# Altium schematic sheet HaptikGeriBeslemeDevresi_Schematic.SchDoc
size A4; SheetNumber: 1; SheetTotal: 1
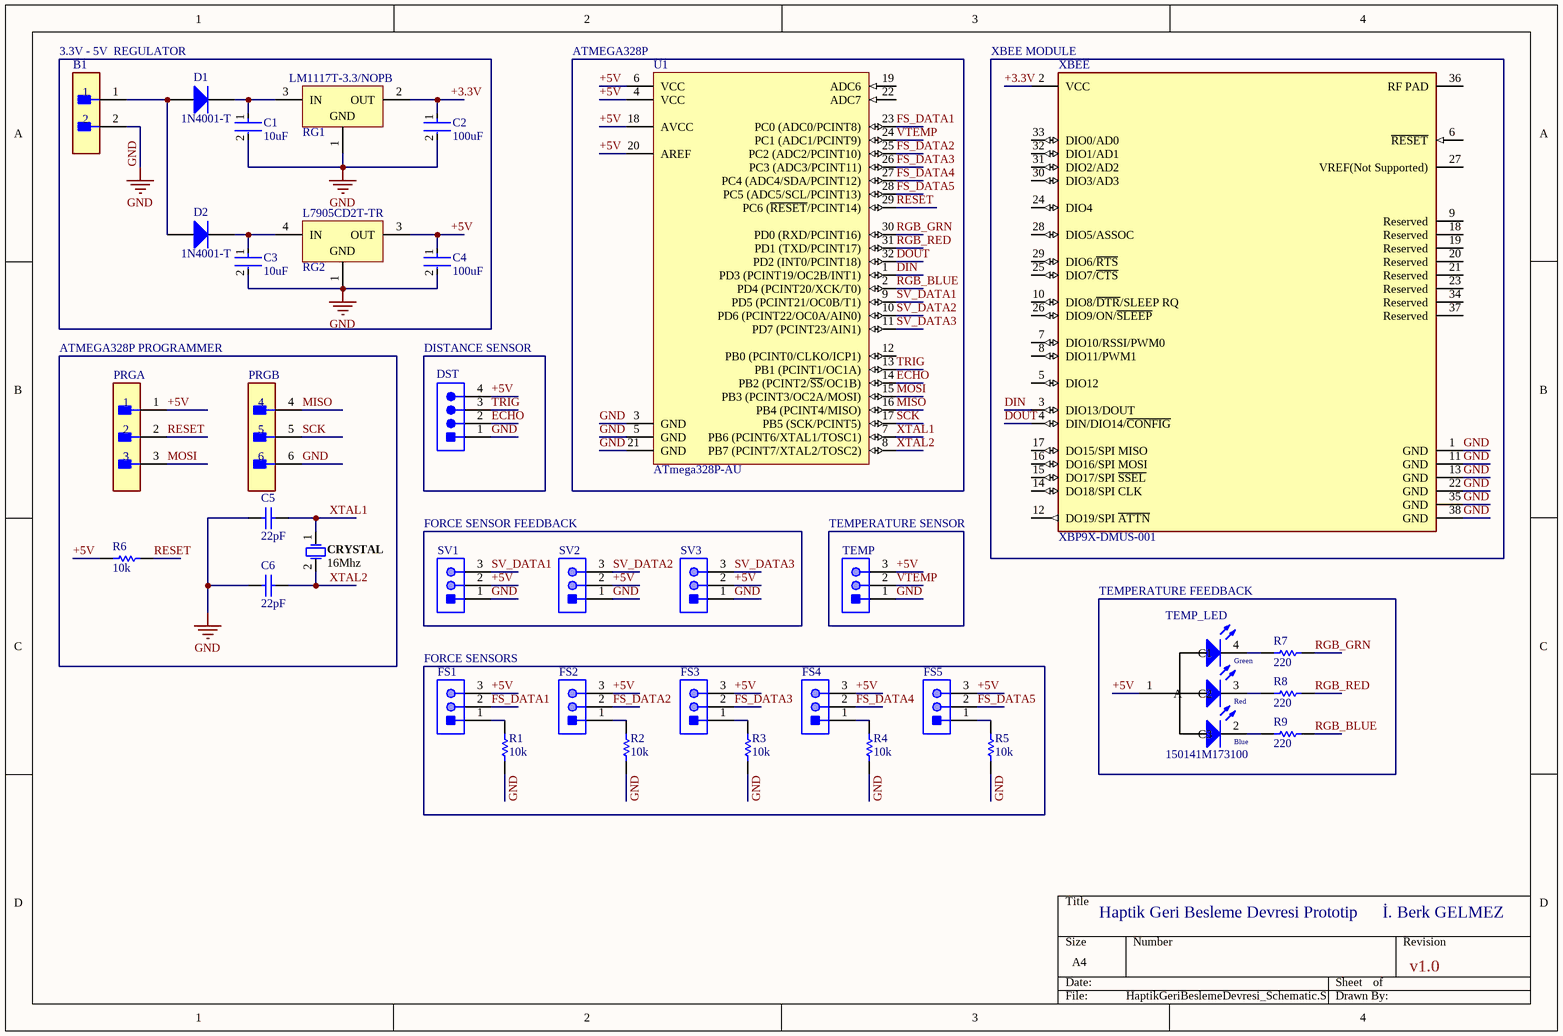
[diagram p0: HaptikGeriBeslemeDevresi_Schematic.SchDoc]

## Parts
B1  90136-1202  [FP-90136-1202-MFG]  (value not drawn)
C1  10uF  [FP-C1608-080-MFG]
C2  100uF  [FP-C3216X5R1A107M160AC-MFG]
C3  10uF  [FP-GRM21B-0_1-IPC_C]
C4  100uF  [FP-C3216X5R1A107M160AC-MFG]
C5  22pF  [CAPC1608X90X35ML10T15]
C6  22pF  [CAPC1608X90X35ML10T15]
CRYSTAL  16Mhz  [FOX-FOXSLF160-20]
D1  1N4001-T  [DIOD-DO-41-P-2_V]
D2  1N4001-T  [DIOD-DO-41-P-2_V]
DST  B4B-EH-A(LF)(SN)  [JST-B4B-EH-A_V]  (value not drawn)
FS1  B3B-PH-K-S(LF)(SN)  [JST-B3B-PH-K-S-3_V]  (value not drawn)
FS2  B3B-PH-K-S(LF)(SN)  [JST-B3B-PH-K-S-3_V]  (value not drawn)
FS3  B3B-PH-K-S(LF)(SN)  [JST-B3B-PH-K-S-3_V]  (value not drawn)
FS4  B3B-PH-K-S(LF)(SN)  [JST-B3B-PH-K-S-3_V]  (value not drawn)
FS5  B3B-PH-K-S(LF)(SN)  [JST-B3B-PH-K-S-3_V]  (value not drawn)
PRG  IPL1-103-02-L-D-K  [FP-IPL1-103-02-L-D-K-0]  (value not drawn)  (parts A,B of 2)
R1  10k  [RESC1609X55X30LL15T15]
R2  10k  [RESC1609X55X30LL15T15]
R3  10k  [RESC1609X55X30LL15T15]
R4  10k  [RESC1609X55X30LL15T15]
R5  10k  [RESC1609X55X30LL15T15]
R6  10k  [RESC1609X55X30LL15T15]
R7  220  [RESC1608X55X30LL15T15]
R8  220  [RESC1608X55X30LL15T15]
R9  220  [RESC1608X55X30LL15T15]
RG1  LM1117T-3.3/NOPB  [NDE0003A]
RG2  L7905CD2T-TR  [TO-263_L]
SV1  B3B-PH-K-S(LF)(SN)  [JST-B3B-PH-K-S-3_V]  (value not drawn)
SV2  B3B-PH-K-S(LF)(SN)  [JST-B3B-PH-K-S-3_V]  (value not drawn)
SV3  B3B-PH-K-S(LF)(SN)  [JST-B3B-PH-K-S-3_V]  (value not drawn)
TEMP  B3B-PH-K-S(LF)(SN)  [JST-B3B-PH-K-S-3_V]  (value not drawn)
TEMP_LED  150141M173100  [3528_A]
U1  ATmega328P-AU  [32A_M]
XBEE  XBP9X-DMUS-001  [FP-XBP9X-DMUS-001-MFG]

## Nets
GND: B1.2 C1.2 C2.2 C3.2 C4.2 C5.1 C6.1 DST.1 PRG.6 R1.1 R2.1 R3.1 R4.1 R5.1 RG1.1(GND) RG2.1(GND) SV1.1 SV2.1 SV3.1 TEMP.1 U1.3(GND) U1.5(GND) U1.21(GND) XBEE.1(GND) XBEE.11(GND) XBEE.13(GND) XBEE.22(GND) XBEE.35(GND) XBEE.38(GND)
+3.3V: C2.1 RG1.2(OUT) XBEE.2(VCC)
+5V: C4.1 DST.4 FS1.3 FS2.3 FS3.3 FS4.3 FS5.3 PRG.1 R6.2 RG2.3(OUT) SV1.2 SV2.2 SV3.2 TEMP.3 TEMP_LED.1(A) U1.4(VCC) U1.6(VCC) U1.18(AVCC) U1.20(AREF)
DIN: U1.1(PD3_(PCINT19/OC2B/INT1)) XBEE.3(DIO13/DOUT)
DOUT: U1.32(PD2_(INT0/PCINT18)) XBEE.4(DIN/DIO14/~{CONFIG})
ECHO: DST.2 U1.14(PB2_(PCINT2/~{SS}/OC1B))
FS_DATA1: FS1.2 U1.23(PC0_(ADC0/PCINT8))
FS_DATA2: FS2.2 U1.25(PC2_(ADC2/PCINT10))
FS_DATA3: FS3.2 U1.26(PC3_(ADC3/PCINT11))
FS_DATA4: FS4.2 U1.27(PC4_(ADC4/SDA/PCINT12))
FS_DATA5: FS5.2 U1.28(PC5_(ADC5/SCL/PCINT13))
MISO: PRG.4 U1.16(PB4_(PCINT4/MISO))
MOSI: PRG.3 U1.15(PB3_(PCINT3/OC2A/MOSI))
RESET: PRG.2 R6.1 U1.29(PC6_(~{RESET}/PCINT14))
RGB_BLUE: R9.2 U1.2(PD4_(PCINT20/XCK/T0))
RGB_GRN: R7.2 U1.30(PD0_(RXD/PCINT16))
RGB_RED: R8.2 U1.31(PD1_(TXD/PCINT17))
SCK: PRG.5 U1.17(PB5_(SCK/PCINT5))
SV_DATA1: SV1.3 U1.9(PD5_(PCINT21/OC0B/T1))
SV_DATA2: SV2.3 U1.10(PD6_(PCINT22/OC0A/AIN0))
SV_DATA3: SV3.3 U1.11(PD7_(PCINT23/AIN1))
TRIG: DST.3 U1.13(PB1_(PCINT1/OC1A))
VTEMP: TEMP.2 U1.24(PC1_(ADC1/PCINT9))
XTAL1: C5.2 CRYSTAL.1 U1.7(PB6_(PCINT6/XTAL1/TOSC1))
XTAL2: C6.2 CRYSTAL.2 U1.8(PB7_(PCINT7/XTAL2/TOSC2))
NetB1_1: B1.1 D1.1(A) D2.1(A)
NetC1_1: C1.1 D1.2(K) RG1.3(IN)
NetC3_1: C3.1 D2.2(K) RG2.4(IN)
NetFS1_1: FS1.1 R1.2
NetFS2_1: FS2.1 R2.2
NetFS3_1: FS3.1 R3.2
NetFS4_1: FS4.1 R4.2
NetFS5_1: FS5.1 R5.2
NetR7_1: R7.1 TEMP_LED.4(C1)
NetR8_1: R8.1 TEMP_LED.3(C2)
NetR9_1: R9.1 TEMP_LED.2(C3)

Not connected (* = marked no-connect by the designer): U1 12(PB0_(PCINT0/CLKO/ICP1)) 19(ADC6) 22(ADC7); XBEE 5(DIO12) 6(~{RESET}) 7(DIO10/RSSI/PWM0) 8(DIO11/PWM1) 9(Reserved) 10(DIO8/~{DTR}/SLEEP_RQ) 12(DO19/SPI_~{ATTN}) 14(DO18/SPI_CLK) 15(DO17/SPI_~{SSEL}) 16(DO16/SPI_MOSI) 17(DO15/SPI_MISO) 18(Reserved) 19(Reserved) 20(Reserved) 21(Reserved) 23(Reserved) 24(DIO4) 25(DIO7/~{CTS}) 26(DIO9/ON/~{SLEEP}) 27(VREF(Not_Supported)) 28(DIO5/ASSOC) 29(DIO6/~{RTS}) 30(DIO3/AD3) 31(DIO2/AD2) 32(DIO1/AD1) 33(DIO0/AD0) 34(Reserved) 36(RF_PAD) 37(Reserved)

## Notes on the sheet
- 3.3V - 5V  REGULATOR
- (near U1) ATMEGA328P
- (near XBEE) XBEE MODULE
- ATMEGA328P PROGRAMMER
- (near DST) DISTANCE SENSOR
- FORCE SENSOR FEEDBACK
- (near TEMP) TEMPERATURE SENSOR
- TEMPERATURE FEEDBACK
- (near FS1) FORCE SENSORS
- Haptik Geri Besleme Devresi Prototip
- İ. Berk GELMEZ
- v1.0
- (in symbol CMP-1431-00001-1) Green; Red; Blue

## Library data of the parts
B1 = CMP-04776-000259-1: CONN HEADER VERT 2POS 2.54MM; Insulation Resistance: 5GR; Max Voltage Rating (DC): 350.35kV; Voltage Rating (AC): 350V; Number of Contacts: 2; Gender: Male; Glow Wire Compliant: Non-compliant; Contact Resistance: 20mR; Current Rating: 3A; Series: C-Grid III; Contact Material: Brass; Contact Plating: Gold; Flammability Rating: UL94 V-0; Housing Color: Black; Max Operating Temperature: 125°C; Housing Material: Polyester; Min Operating Temperature: -55°C; Package Quantity: 3040; Voltage Rating: 350V; Number of Positions: 2; Working Voltage: 350V; Lead Pitch: 2.54mm; Termination: Through Hole; Color: Black; Packaging: Tray; Lead Free: Lead Free; Voltage Rating (DC): 350V; Orientation: Vertical; Number of Poles: 2; RoHS Compliant: Yes; Number of Rows: 1; Pitch: 2.54mm; Radiation Hardening: No; Number of Circuits: 2; Mount: Through Hole
C1 = CMP-2000-04979-2: CAP CER 10UF 10V X5R 0603; Manufacturer Part Number: C1608X5R1A106K080AC; Manufacturer: TDK; Temperature Coefficient: 15%; Tolerance: 10%; Material: Ceramic; Mouser Description: CAP CER 10UF 10V X5R 0603; Package: C1608-080; Lead Free: Yes; Device Class L1: Passive Components; Value: 10uF; Temperature Range High: +85°C; Octopart: https://octopart.com/c1608x5r1a106k080ac-tdk-26013468; Voltage: 10V; Footprint Url: https://product.tdk.com/info/en/catalog/spec/mlccspec_commercial_general_midvoltage_en.pdf; Ipc Land Pattern Name: CAPC16080X80; Temperature Range Low: -55°C; Temperature: -55°C to +85°C; ComponentLink2Description: Datasheet; ComponentLink2URL: https://product.tdk.com/info/en/documents/chara_sheet/C1608X5R1A106K080AC.pdf; Height: 0.9mm; Temperature Characteristic: X5R; RoHS: TRUE; Category: Cap; Capacitance: 10uF; Digikey Description: CAP CER 10UF 10V X5R 0603; Automotive: No; Device Class L3: Ceramic Capacitors; Device Class L2: Capacitors; Voltage Rating: 10V
C2 C4 = CMP-2000-05396-2: CAP CER 100UF 10V X5R 1206; Manufacturer: TDK Corporation; Manufacturer Part Number: C3216X5R1A107M160AC; Temperature Coefficient: 15%; Tolerance: 20%; Material: Ceramic; Voltage Rating: 10V; Automotive: No; Ipc Land Pattern Name: CAPC320160X160; Height: 1.9mm; ComponentLink2URL: https://product.tdk.com/info/en/catalog/spec/mlccspec_commercial_general_midvoltage_en.pdf; Temperature: -55°C to +85°C; Lead Free: Yes; Digikey Description: CAP CER 100UF 10V X5R 1206; Device Class L2: Capacitors; Device Class L3: Ceramic Capacitors; Capacitance: 100uF; Temperature Characteristic: X5R; Package: C3216X5R1A107M160AC; Temperature Range High: +85°C; Category: Cap; Device Class L1: Passive Components; Value: 100uF; Octopart: https://octopart.com/c3216x5r1a107m160ac-tdk-25947775; Temperature Range Low: -55°C; RoHS: TRUE; ComponentLink2Description: Datasheet; Mouser Description: CAP CER 100UF 10V X5R 1206
C3 = CMP-2007-03453-2: Chip Multilayer Ceramic Capacitors for General Purpose, 0805, 10uF, X5R, 15%, 10%, 16V; Radiation Hardening: No; Thickness: 0.053inch; Voltage Rating (DC): 16V; Lead Free: Lead Free; Package Quantity: 1; Width: 1.25mm; Case Code (Imperial): 0805; Depth: 1.25mm; Packaging: Tape and Reel; Dielectric: X5R; Max Operating Temperature: 85°C; Tolerance: 10%; Voltage Rating: 16V; Voltage: 16V; Capacitance: 10uF; Height: 1.25mm; Case Code (Metric): 2012; Material: Ceramic; Mount: Surface Mount; Case/Package: 0805; REACH SVHC: No SVHC; Length: 2mm; Min Operating Temperature: -55°C; Termination: SMD/SMT
C5 C6 = CMP-2000-04945-1: Chip Capacitor, 22 pF, +/- 5%, 50 V, -55 to 125 degC, 0603 (1608 Metric), RoHS, Tape and Reel; Manufacturer: Murata; Rated Voltage: 50V; Dielectric: C0G; Capacitance: 22pF; Manufacturer URL: http://www.murata.com/; Datasheet Version: Jul-06; Package Reference: 603; Tolerance (%): ±5%; Case Size/Dimension: 0603; Package Description: 2-Pin Surface Mount Device, Body 1.6 x 0.8 mm; Datasheet URL: https://datasheet.ciiva.com/11786/0900766b807a1cab-11786398.pdf
CRYSTAL = CMP-1749-00003-1: Resistance Weld Thru-Hole Crystal, 16 MHz, -20 to 70 degC, 2-Pin THD, RoHS, Bulk; Voltage Rating: 250 V; Tolerance: 1%; Resistance: 221 kohm; Case\Package: Axial; Power Rating: 250 mW; RoHSCompliant: true; Package Quantity: 200; Packaging: Bulk; Min Operating Temperature: -55 degC; DatasheetVersion: Mar-15; ComponentLink1URL: http://www.foxonline.com/; Max Operating Temperature: 155 degC; PackageReference: FOXSLF160-20; Mount: Through Hole; PackageDescription: 2-Pin Through Hole Device, Body 11.35 x 4.65 mm; ComponentLink1Description: Manufacturer URL; ComponentLink2URL: http://www.foxonline.com/pdfs/hc49slf.pdf; ComponentLink2Description: Datasheet; Length: 0.248 inch
D1 D2 = CMP-0639-00006-2: 1.0 A Rectifier, 15 pF, 50 V, -65 to 150 degC, 2-Pin DO-41 Plastic, RoHS, Tape and Reel; Manufacturer: Diodes Inc; VF (V): 1; CT (pF): 15; Max. IR (uA): 5; VRRM (V): 50; Max. IFSM (A): 30; RoHS: TRUE; Mounting Technology: Through Hole; PartNumber: 1N4001-T; ComponentLink2Description: Datasheet; DatasheetVersion: Rev. 8-2; Operating Temperature Range (degC): -65 to 150; Packing: Tape and Reel; PackageReference: DO-41-P-2; ComponentLink1URL: http://diodes.com/; PackageDescription: 2-Pin Axial Lead, Body 4.635 x 2.36 mm, Lead Spread 25.4 mm; ComponentLink2URL: http://diodes.com/datasheets/ds28002.pdf; Max. Average Rectified Current IO (A): 1; ComponentLink1Description: Manufacturer URL
DST = CMP-2000-05904-1: Male Header, Pitch 2.5 mm, 1 x 4 Position, Height 6 mm, Tail Length 3.2 mm, -25 to 85 degC, RoHS, Bulk; Manufacturer: JST; Style/Orientation: StraightHeader/Plug; Pitch: 2.5mm; No of Positions: 4; Mounting Technology: SurfaceMount; Package Description: Male Header, Pitch 2.5 mm, 1 x 4 Position, Height 6 mm, Tail Length 3.2 mm; Datasheet Version: 12/2012; Type: ShroudedHeader; Package Reference: B4B-EH-A; Manufacturer URL: http://www.jst.com/home2.html; Termination: Crimp; Datasheet URL: http://www.jst-mfg.com/product/pdf/eng/eEH.pdf
FS1-FS5 SV1-SV3 TEMP = CMP-2000-05164-1: Male Header, Pitch 2 mm, 1 x 3 Position, Height 6 mm, Tail Length 3.4 mm, -25 to 85 degC, RoHS, Bulk; Manufacturer: JST; Style/Orientation: StraightHeader/Plug; Pitch: 2mm; No of Positions: 3; Termination: Crimp; Manufacturer URL: http://www.jst.com/home2.html; Datasheet Version: Oct-06; Type: ShroudedHeader; Datasheet URL: https://datasheet.ciiva.com/11746/0900766b80826550-11746939.pdf
PRG = CMP-02766-000692-1: 3 Position 2 Row .100" (2.54 mm) pitch connector; Pitch: 2.54mm; Max Current Rating: 7.4A; Max Voltage Rating (AC): 675V; Number of Ports: 1; Number of Contacts: 6; Gender: Male; Housing Material: Polymer; Depth: 9.58mm; Orientation: Straight; Termination: Solder; Mount: Surface Mount; Length: 9.14mm; Packaging: Bulk; Contact Material: Bronze; Max Operating Temperature: 125°C; Contact Plating: Gold; Radiation Hardening: No; Min Operating Temperature: -55°C; Number of Terminals/Pins: 6
R1-R6 = CMP-1012-00623-3: Chip Resistor, 10 KOhm, +/- 1%, 0.1 W, -55 to 155 degC, 0603 (1608 Metric), RoHS, Tape and Reel; Manufacturer: Panasonic; Voltage Rating: 75V; Case\/Package: 0603; Power Rating: 100mW; Resistance: 10KOhm; Temperature Coefficient: 100ppm\/degreesC; Number of Pins: 2; Package Reference: 603; Depth: 0.8mm; Mount: SurfaceMount; Package Description: 2-Pin Surface Mount Device, Body 1.6 x 0.85 mm; Datasheet Version: 02/2017; Length: 1.6mm; Lead Free: LeadFree; Height: 0.45mm; Number of Terminations: 2; Max Power Dissipation: 100mW; Min Operating Temperature: -55degC; Datasheet URL: https://industrial.panasonic.com/cdbs/www-data/pdf/RDA0000/AOA0000C304.pdf; Termination: SMD/SMT; Case Code (Metric): 1608; Case Code (Imperial): 0603; Tolerance: 1%; Max Operating Temperature: 155degC; RoHSCompliant: true; Voltage Rating (DC): 75V; Radiation Hardening: No; Packaging: TapeandReel; Composition: ThickFilm; Mounting Technology: SurfaceMount; Manufacturer URL: http://www.panasonic.com/; Width: 0.031inch; REACH SVHC: NoSVHC; Contact Plating: Tin; Military Standard: Not; Package Quantity: 1
R7-R9 = CMP-2000-00335-2: Chip Resistor, 220 Ohm, +/- 1%, 0.1 W, -55 to 155 degC, 0603 (1608 Metric), RoHS, Tape and Reel; Voltage Rating: 50 V; Resistance: 22 Ohm; Power Rating: 100 mW; Case\Package: 0603; ComponentLink2Description: Datasheet; PackageDescription: 2-Pin Surface Mount Device, Body 1.6 x 0.85 mm; PackageReference: 0603; ComponentLink1Description: Manufacturer URL; ComponentLink2URL: http://industrial.panasonic.com/cdbs/www-data/pdf/RDA0000/AOA0000C86.pdf; Height: 0.45 mm; Mount: Surface Mount; Case Code (Metric): 1608; Pins: 2; Width: 0.8 mm; Length: 1.6 mm; Package Quantity: 5000; Tolerance: 1%; ComponentLink1URL: http://www.panasonic.com/; Max Operating Temperature: 155 degC; Min Operating Temperature: -55 degC; RoHSCompliant: true; Packaging: Tape and Reel; Case Code (Imperial): 0603; DatasheetVersion: Apr-15; REACH SVHC: No SVHC; Voltage Rating (DC): 50 V
RG1 = CMP-0062-02494-3: 800mA Low-Dropout Linear Regulator, 3-pin TO-220, Pb-Free; Manufacturer: Texas Instruments; PackageTopMarking: NSUZXYTTE#*LM1117T*3.3; PowerWise: N; CompType: LDO IC; RoHS: Y; ComponentLink1URL: http://www.ti.com/general/docs/lit/getliterature.tsp?genericPartNumber=LM1117-N&fileType=pdf; PackageReference: NDE0003A; PinCount: 3; ComponentLink1Description: Datasheet URL; PackageDescription: TO-220, Molded, 3 Lead, Straight
RG2 = CMP-0244-00191-1: Negative Voltage Regulator, -5V, 3-Pin D2PAK, Tape and Reel; PackageReference: TO-263; ComponentLink2URL: http://www.st.com/internet/com/TECHNICAL_RESOURCES/TECHNICAL_LITERATURE/DATASHEET/CD00000450.pdf; PackageVersion: 2011; ComponentLink1Description: Manufacturer URL; ComponentLink2Description: Datasheet; PackageDescription: 3-Pin Transistor Outline Package 2.54 mm Pitch, 15.4 mm Lead Span (D2PAK); ComponentLink1URL: http://www.st.com; DatasheetVersion: 1/11/2011
TEMP_LED = CMP-1431-00001-1: SMD Full-Color Top LED, WL-SFTW, Red & Green & Blue; Manufacturer: Wuerth Elektronik; PackageReference: 3528_A; PartNumber: 150141M173100; ComponentLink2Description: Datasheet; ComponentLink1URL: http://www.we-online.com; Color: Red & Green & Blue; ComponentLink1Description: Manufacturer URL; ComponentLink2URL: http://katalog.we-online.com/led/datasheet/150141M173100.pdf
U1 = CMP-0095-00269-2: 8-bit AVR Microcontroller, 32KB Flash, 1KB EEPROM, 2KB SRAM, 32-pin TQFP, Industrial Grade (-40°C to 85°C); PackageDescription: 32-Lead, 7x7x1.0 mm Body, 0.8mm Lead Pitch, Thin Profile Plastic Quad Flat Package (TQFP); DatasheetVersion: revD, May-2011; RevisionNote: DatasheetVersion & PackageVersion updated. URLs added.; ComponentLink1URL: http://www.atmel.com/; ComponentLink2Description: ATmega48A/48PA/88A/88PA/168A/168PA/328/328P Datasheet; Code_JEDEC: MS-026-ABA; ComponentLink1Description: Manufacturer URL; PackageReference: 32A; ComponentLink3Description: ATmega48A/48PA/88A/88PA/168A/168PA/328/328P Summary; ComponentLink2URL: http://www.atmel.com/dyn/resources/prod_documents/doc8271.pdf; PackageVersion: revC, Oct-2010; ComponentLink3URL: http://www.atmel.com/dyn/resources/prod_documents/8271S.pdf
XBEE = CMP-84319-000001-1: XBEE PRO MOD TXRX ISM 915MHZ UFL; Manufacturer: Digi International; Min Supply Voltage: 2.4V; Max Supply Voltage: 3.6V; Number Of Adc Channels: 4; Interface: SPI,UART; Receiving Current: 40mA; Bandwidth: 26MHz; Max Frequency: 928MHz; Transmitting Current: 330-900mA; Data Rate: 250kbits/s; Sensitivity: -103dBm; Number Of Gpio: 20; Automotive: No; Lead Free: Yes; Package: 0; Height: 3.556mm; Temperature Range Low: -40°C; Temperature Range High: +85°C; Temperature: -40°C to +85°C; Device Class L1: Integrated Circuits (ICs); Category: UNK; Device Class L3: Transceivers; ComponentLink2URL: https://www.digi.com/resources/documentation/digidocs/pdfs/90001477.pdf; Digikey Description: XBEE PRO MOD TXRX ISM 915MHZ UFL; Octopart: https://octopart.com/xbp9x-dmus-001-digi+international-71530758; Device Class L2: RF Semiconductors and Devices; ComponentLink2Description: Datasheet; RoHS: TRUE; Manufacturer Part Number: XBP9X-DMUS-001